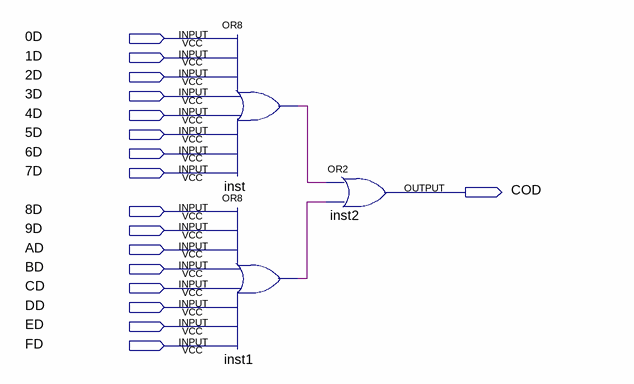
[diagram p0: schematic sheet]
// Quartus schematic COLUNA_D.bdf as structural Verilog: 3 symbols, 17 pins
module COLUNA_D (
  input  \0D ,
  input  \1D ,
  input  \2D ,
  input  \3D ,
  input  \4D ,
  input  \5D ,
  input  \6D ,
  input  \7D ,
  input  \8D ,
  input  \9D ,
  input  AD,
  input  BD,
  input  CD,
  input  DD,
  input  ED,
  input  FD,
  output COD
);

  wire inst1_out, inst_out;

  or inst (inst_out, \0D , \1D , \2D , \3D , \4D , \5D , \6D , \7D );
  or inst1 (inst1_out, \8D , \9D , AD, BD, CD, DD, ED, FD);
  or inst2 (COD, inst_out, inst1_out);
endmodule
